# Altium schematic sheet DLY-056_电机原理图.SchDoc
size A3
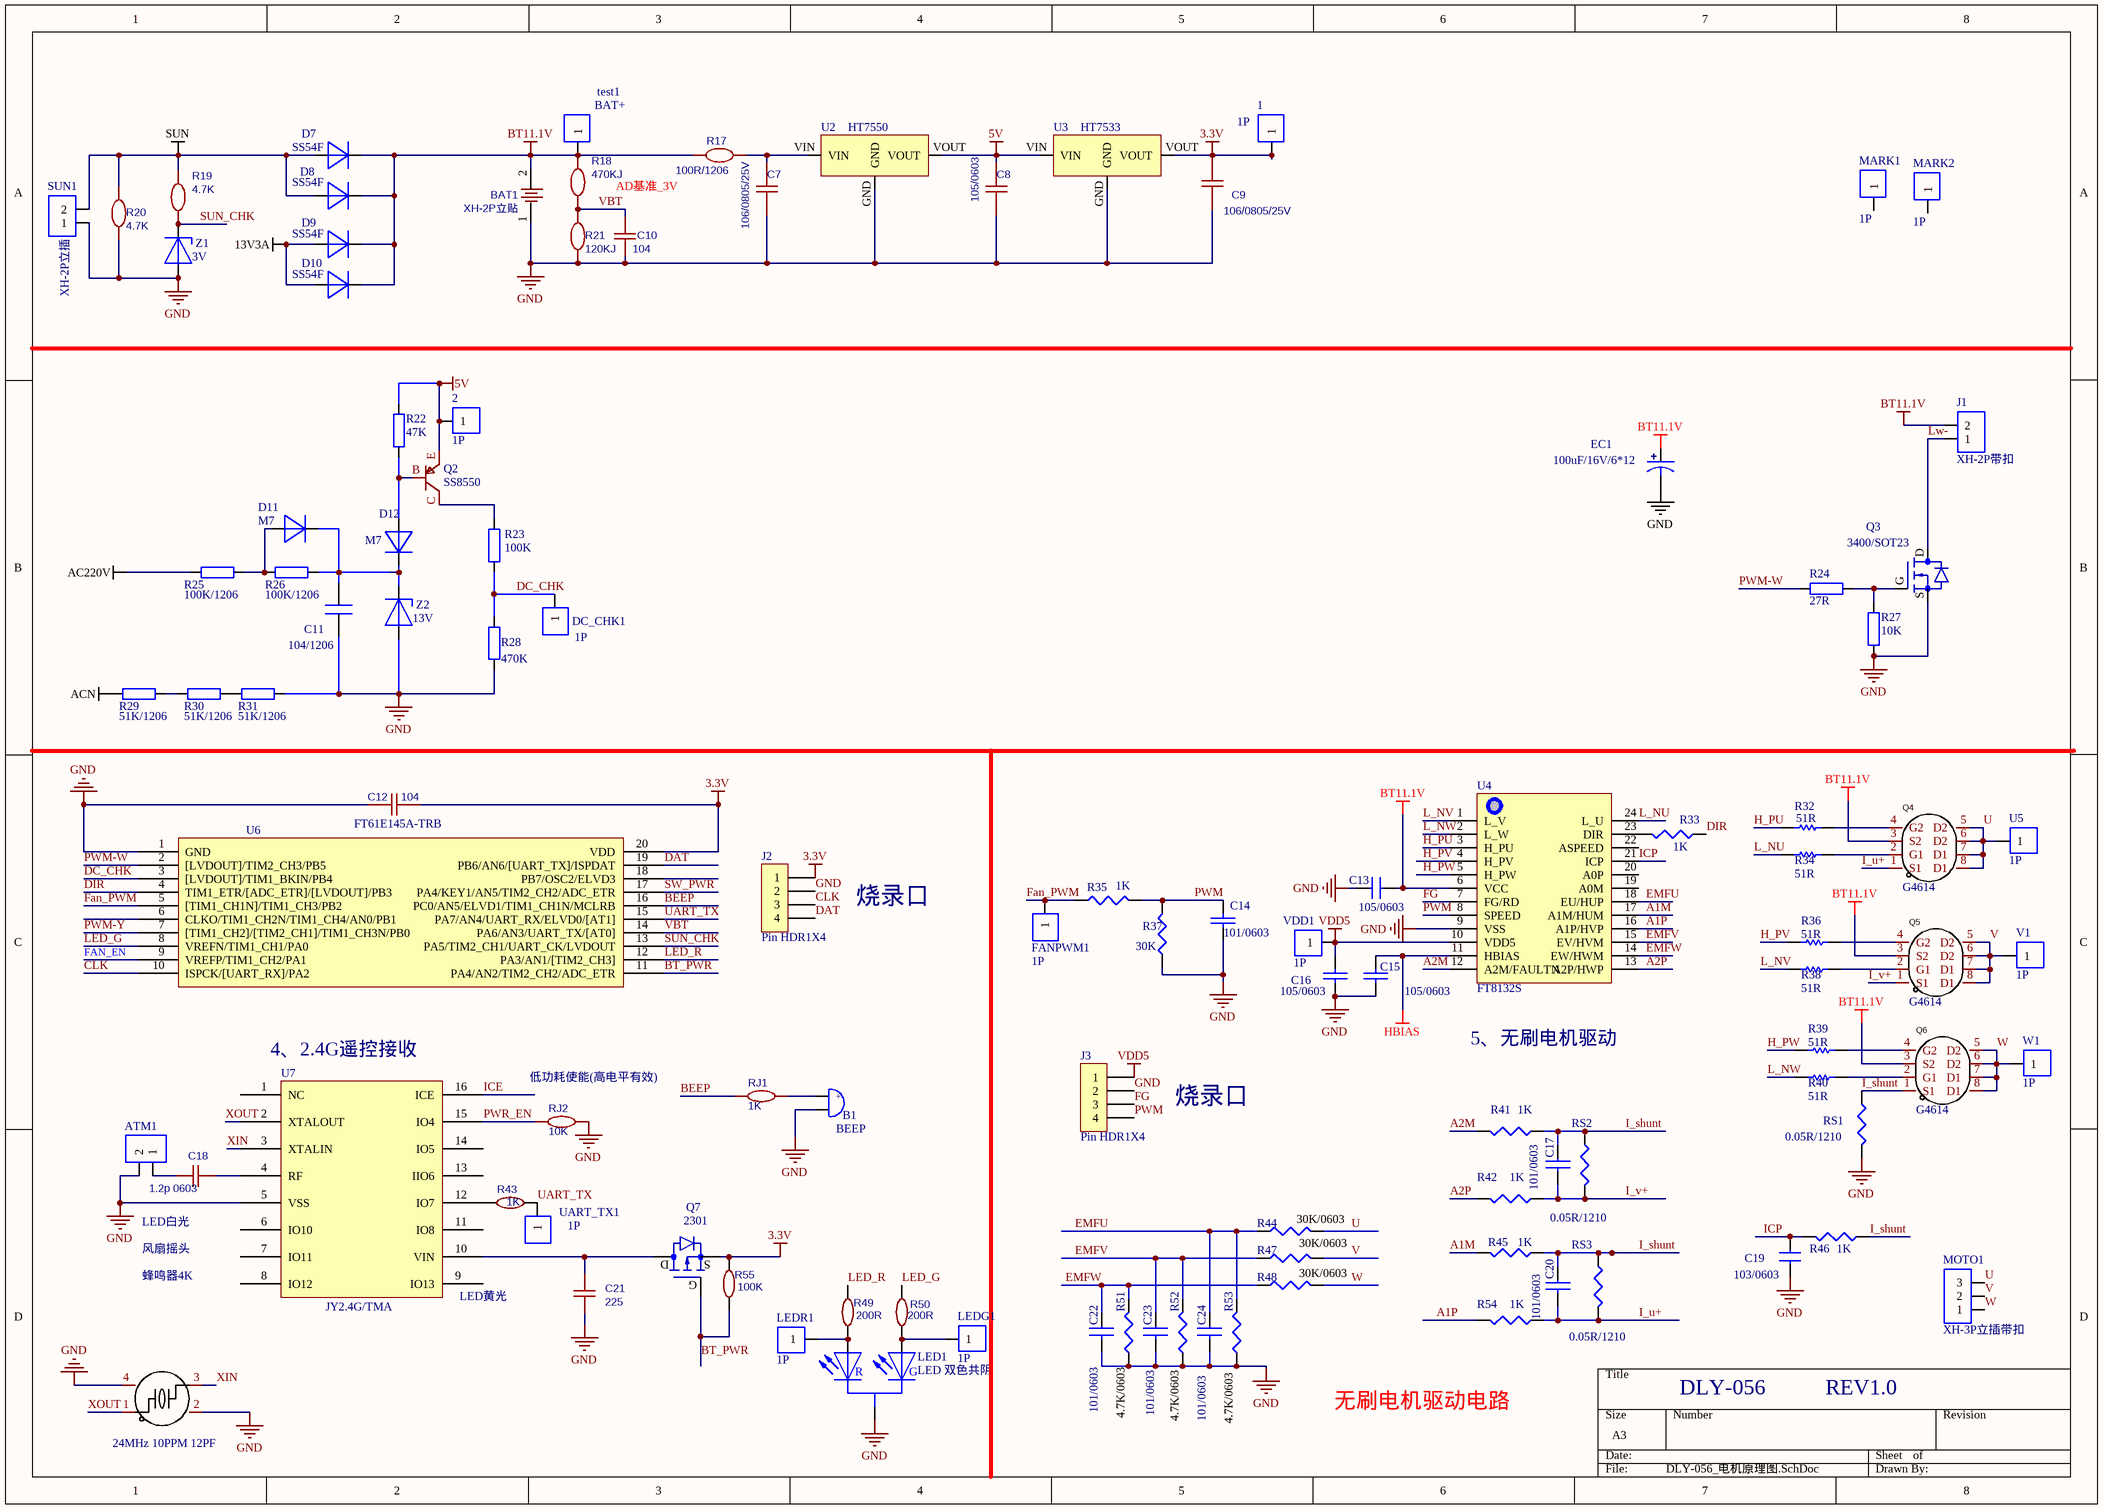
[diagram p0: DLY-056_电机原理图.SchDoc]

## Parts
1  1P  [TEST3.0_top]
2  1P  [TEST3.0_top]
ATM1  2P  [SMT-ATN天线]  (value not drawn)
B1  BEEP  [MI-蜂鸣器-1407]
BAT1  XH-2P立贴  [MI-VH2-2.5]
C7  106/0805/25V  [0805_c]
C8  105/0603  [0603_c]
C9  106/0805/25V  [0603_c]
C10  104  [0603_C]
C11  104/1206  [1206_C]
C12  104  [0603_C]
C13  105/0603  [0603_C]
C14  101/0603  [0603_C]
C15  105/0603  [0603_C]
C16  105/0603  [0603_C]
C17  101/0603  [0603_C]
C18  1.2p 0603  [0603_C]
C19  103/0603  [0603_C]
C20  101/0603  [0603_C]
C21  225  [0603_C]
C22  101/0603  [0603_C]
C23  101/0603  [0603_C]
C24  101/0603  [0603_C]
D7  SS54F  [SMT-SMA]
D8  SS54F  [SMT-SMA]
D9  SS54F  [SMT-SMA]
D10  SS54F  [SMT-SMA]
D11  M7  [SMT-SOD123锡膏]
D12  M7  [SMT-SOD123锡膏]
DC_CHK1  1P  [TEST3.0_top]
EC1  100uF/16V/6*12  [DIP-EC2.5X6.3X11.2]
FANPWM1  1P  [TEST3.0_top]
J1  XH-2P带扣  [MI-VH2-2.5]
J2  Pin HDR1X4  [烧录口]
J3  Pin HDR1X4  [烧录口]
LED1  LED 双色共阴  [PH2.0-3P]
LEDG1  1P  [TEST3.0_top]
LEDR1  1P  [TEST3.0_top]
MARK1  1P  [SMT-MARK]
MARK2  1P  [SMT-MARK]
MOTO1  XH-3P立插带扣  [MI-VH3-2.5]
Q2  SS8550  [SMT-三极管-SOT23锡膏]
Q3  3400/SOT23  [SMT-MOS管-SOT23锡膏]
Q4  G4614  [SOIC-8_150mil]
Q5  G4614  [SOIC-8_150mil]
Q6  G4614  [SOIC-8_150mil]
Q7  2301  [SMT-MOS管-SOT23锡膏]
R17  100R/1206  [SMT-1206r]
R18  470KJ  [0603_R]
R19  4.7K  [0603_R]
R20  4.7K  [0603_R]
R21  120KJ  [0603_R]
R22  47K  [SMT-0603R]
R23  100K  [SMT-0603R]
R24  27R  [SMT-0603R]
R25  100K/1206  [SMT-1206]
R26  100K/1206  [SMT-1206]
R27  10K  [SMT-0603R]
R28  470K  [SMT-0603R]
R29  51K/1206  [SMT-1206]
R30  51K/1206  [SMT-1206]
R31  51K/1206  [SMT-1206]
R32  51R  [SMT-0603R]
R33  1K  [SMT-0603R]
R34  51R  [SMT-0603R]
R35  1K  [SMT-0603R]
R36  51R  [SMT-0603R]
R37  30K  [SMT-0603R]
R38  51R  [SMT-0603R]
R39  51R  [SMT-0603R]
R40  51R  [SMT-0603R]
R41  1K  [SMT-0603R]
R42  1K  [SMT-0603R]
R43  1K  [SMT-0603R]
R44  30K/0603  [SMT-0603R]
R45  1K  [SMT-0603R]
R46  1K  [SMT-0603R]
R47  30K/0603  [SMT-0603R]
R48  30K/0603  [SMT-0603R]
R49  200R  [SMT-0603R]
R50  200R  [SMT-0603R]
R51  4.7K/0603  [SMT-0603R]
R52  4.7K/0603  [SMT-0603R]
R53  4.7K/0603  [SMT-0603R]
R54  1K  [SMT-0603R]
R55  100K  [SMT-0603R]
RJ1  1K  [SMT-0603R]
RJ2  10K  [SMT-0603R]
RS1  0.05R/1210  [SMT-1210]
RS2  0.05R/1210  [SMT-1210]
RS3  0.05R/1210  [SMT-1210]
SUN1  XH-2P立插  [MI-VH2-2.5]
test1  BAT+  [test3.0_top]
U2  HT7550  [SMT-LDO-SOT23锡膏]
U3  HT7533  [SMT-LDO-SOT23锡膏]
U4  FT8132S  [TSSOP-24]
U5  1P  [TEST3.0_top]
U6  FT61E145A-TRB  [TSSOP-20]
U7  JY2.4G/TMA  [SOIC-16_150mil]
UART_TX1  1P  [TEST3.0_top]
V1  1P  [TEST3.0_top]
VDD1  1P  [TEST3.0_top]
W1  1P  [TEST3.0_top]
X1  X32258MOB4SI  [OSC 3225-4P]  (value not drawn)
Z1  3V  [SMT-SOD123锡膏]
Z2  13V  [SMT-SOD123锡膏]

## Nets
3.3V: 1.1 C9.1 C12.1 J2.1 Q7.S R55.1 U3.VOUT U6.20(VDD)
5V: 2.1 C8.1 Q2.E R22.2 U2.VOUT U3.VIN
13V3A: D9.1 D10.1
AC220V: R25.1
ACN: R29.1
BT11.1V: BAT1.2 C13.2 D7.2 D8.2 D9.2 D10.2 EC1.1 J1.2 Q4.3(S2) Q5.3(S2) Q6.3(S2) R17.2 R18.2 test1.1 U4.6(VCC)
GND: ATM1.2 B1.2 BAT1.1 C7.2 C8.2 C9.2 C10.2 C11.1 C12.2 C13.1 C14.2 C15.1 C16.1 C19.2 C21.1 C22.2 C23.2 C24.2 EC1.2 J2.2 J3.2 LED1.2 Q3.S R20.1 R21.1 R27.1 R28.2 R31.2 R37.1 R51.1 R52.1 R53.1 RJ2.1 RS1.2 SUN1.1 U2.GND U3.GND U4.9(VSS) U6.1(GND) U7.5(VSS) X1.2(GND) X1.4(GND) Z1.1 Z2.1
HBIAS: C15.2 U4.11(HBIAS)
SUN: D7.1 D8.1 R19.2 R20.2 SUN1.2
VDD5: C16.2 J3.1 U4.10(VDD5) VDD1.1
A1M: R45.2 U4.17(A1M/HUM)
A1P: R54.2 U4.16(A1P/HVP)
A2M: R41.2 U4.12(A2M/FAULTN)
A2P: R42.2 U4.13(A2P/HWP)
BEEP: RJ1.1 U6.16(PC0/AN5/ELVD1/TIM1_CH1N/MCLRB)
BT_PWR: Q7.G R55.2 U6.11(PA4/AN2/TIM2_CH2/ADC_ETR)
CLK: J2.3 U6.10(ISPCK/[UART_RX]/PA2)
DAT: J2.4 U6.19(PB6/AN6/[UART_TX]/ISPDAT)
DC_CHK: DC_CHK1.1 R23.1 R28.1 U6.3([LVDOUT]/TIM1_BKIN/PB4)
DIR: R33.1 U6.4(TIM1_ETR/[ADC_ETR]/[LVDOUT]/PB3)
EMFU: C24.1 R44.1 R53.2 U4.18(EU/HUP)
EMFV: C23.1 R47.1 R52.2 U4.15(EV/HVM)
EMFW: C22.1 R48.1 R51.2 U4.14(EW/HWM)
FAN_EN: U6.9(VREFP/TIM1_CH2/PA1)
Fan_PWM: FANPWM1.1 R35.1 U6.5([TIM1_CH1N]/TIM1_CH3/PB2)
FG: J3.3 U4.7(FG/RD)
H_PU: R32.1 U4.3(H_PU)
H_PV: R36.1 U4.4(H_PV)
H_PW: R39.1 U4.5(H_PW)
I_shunt: C17.1 C20.1 Q6.1(S1) R41.1 R45.1 R46.1 RS1.1 RS2.1 RS3.1
I_u+: C20.2 Q4.1(S1) R54.1 RS3.2
I_v+: C17.2 Q5.1(S1) R42.1 RS2.2
ICE: U7.16(ICE)
ICP: C19.1 R46.2 U4.21(ICP)
L_NU: R34.1 U4.24(L_U)
L_NV: R38.1 U4.1(L_V)
L_NW: R40.1 U4.2(L_W)
LED_G: R50.1 U6.8(VREFN/TIM1_CH1/PA0)
LED_R: R49.1 U6.12(PA3/AN1/[TIM2_CH3])
Lw-: J1.1 Q3.D
PWM: C14.1 J3.4 R35.2 R37.2 U4.8(SPEED)
PWM-W: R24.1 U6.2([LVDOUT]/TIM2_CH3/PB5)
PWM-Y: U6.7([TIM1_CH2]/[TIM2_CH1]/TIM1_CH3N/PB0)
PWR_EN: RJ2.2 U7.15(IO4)
SUN_CHK: R19.1 U6.13(PA5/TIM2_CH1/UART_CK/LVDOUT) Z1.2
SW_PWR: U6.17(PA4/KEY1/AN5/TIM2_CH2/ADC_ETR)
U: MOTO1.3 Q4.5(D2) Q4.6(D2) Q4.7(D1) Q4.8(D1) R44.2 U5.1
UART_TX: R43.1 U6.15(PA7/AN4/UART_RX/ELVD0/[AT1]) UART_TX1.1
V: MOTO1.2 Q5.5(D2) Q5.6(D2) Q5.7(D1) Q5.8(D1) R47.2 V1.1
VBT: C10.1 R18.1 R21.2 U6.14(PA6/AN3/UART_TX/[AT0])
W: MOTO1.1 Q6.5(D2) Q6.6(D2) Q6.7(D1) Q6.8(D1) R48.2 W1.1
XIN: U7.3(XTALIN) X1.3(XOUT)
XOUT: U7.2(XTALOUT) X1.1(XIN)
NetATM1_1: ATM1.1 C18.2
NetB1_1: B1.1 RJ1.2
NetC7_1: C7.1 R17.1 U2.VIN
NetC11_2: C11.2 D11.2 D12.2 R26.2 Z2.2
NetC18_1: C18.1 U7.4(RF)
NetC21_2: C21.2 Q7.D U7.10(VIN)
NetD11_1: D11.1 R25.2 R26.1
NetD12_1: D12.1 Q2.B R22.1
NetLED1_1: LED1.1 LEDR1.1 R49.2
NetLED1_3: LED1.3 LEDG1.1 R50.2
NetQ2_C: Q2.C R23.2
NetQ3_G: Q3.G R24.2 R27.2
NetQ4_2: Q4.2(G1) R34.2
NetQ4_4: Q4.4(G2) R32.2
NetQ5_2: Q5.2(G1) R38.2
NetQ5_4: Q5.4(G2) R36.2
NetQ6_2: Q6.2(G1) R40.2
NetQ6_4: Q6.4(G2) R39.2
NetR29_2: R29.2 R30.1
NetR30_2: R30.2 R31.1
NetR33_2: R33.2 U4.23(DIR)
NetR43_2: R43.2 U7.12(IO7)

Not connected (* = marked no-connect by the designer): MARK1 1; MARK2 1; U4 19(A0M) 20(A0P) 22(ASPEED); U6 6(CLKO/TIM1_CH2N/TIM1_CH4/AN0/PB1) 18(PB7/OSC2/ELVD3); U7 1(NC) 6(IO10) 7(IO11) 8(IO12) 9(IO13) 11(IO8) 13(IIO6) 14(IO5)

## Notes on the sheet
- 烧录口
- (near U7) 4、2.4G遥控接收
- 5、无刷电机驱动
- (near RJ2) 低功耗使能(高电平有效)
- 风扇摇头
- LED白光
- 蜂鸣器4K
- (near U7) LED黄光
- DLY-056
- REV1.0
- (near X1) 24MHz 10PPM 12PF
- 无刷电机驱动电路
- (in symbol BEEP) +
- (in symbol LED 双色共阴) R; G

## Library data of the parts
B1 = BEEP: 蜂鸣器
BAT1 = 12V: BOM_Manufacturer: Q&J; BOM_Manufacturer Part: CR1220-2; BOM_Supplier: LCSC; image: //image.lceda.cn/szlcsc/C70381.jpg; BOM_Supplier Part: C70381; spicePre: B; spiceSymbolName: CR1220-2
C7-C9 = 0.1u: nameAlias: Value(F); Contributor: LCEDA_Lib; spicePre: C; spiceSymbolName: C_0603_US
C10 = 100nF: BOM_Manufacturer: Walsin Tech Corp; BOM_Manufacturer Part: 0402X224J100CT; nameAlias: Capacitance; Contributor: LCSC; BOM_Supplier: LCSC; BOM_Supplier Part: C295939; spicePre: C; spiceSymbolName: 0402X224J100CT
C11 = Cap
C12 = 102/400V: BOM_Manufacturer: SAMSUNG; BOM_Manufacturer Part: CL10B104KA8NNNC; nameAlias: Capacitance; BOM_Supplier: LCSC; BOM_Supplier Part: C1590; spicePre: C; spiceSymbolName: CL10B104KA8NNNC
C13 C14 C19 = CAP: Capacitor
C15 C16 = CAP-CC: Capacitor
C17 C20 C22-C24 = CAP NP: Text Field1: 20; Text Field2: 10
C18 C21 = 100nF: 0603; BOM_Manufacturer: Walsin Tech Corp; BOM_Manufacturer Part: 0402X224J100CT; nameAlias: Capacitance; Contributor: LCSC; BOM_Supplier: LCSC; BOM_Supplier Part: C295939; spicePre: C; spiceSymbolName: 0402X224J100CT
D7-D12 = Diode
EC1 = SMD_ECAP: 贴片电解电容
J1 SUN1 = 2P
MOTO1 = 3P
Q2 = PNP
Q3 = N MOS
Q4-Q6 = G4614: Add into BOM: yes; Name: G4614; Symbol: G4614; Device: G4614; LCSC Part Name: G4614; Supplier Part: C7465424; Manufacturer Part: G4614; Supplier Footprint: SOP-8; Datasheet: https://atta.szlcsc.com/upload/public/pdf/source/20230719/26D75AFD91122D699FFA118337651D12.pdf; Supplier: LCSC; Convert to PCB: yes
Q7 = P MOS
R17-R21 = 1k: Contributor: LCEDA_Lib; spicePre: R; spiceSymbolName: R_0603_EU
R22-R31 = Res
R32 R34 R36 R38-R40 = RES
R33 R35 R37 R41 R42 R44-R48 R51-R54 RS1-RS3 = RES(SMD)
R43 R49 R50 R55 = 51K: BOM_Manufacturer: UniOhm; BOM_Manufacturer Part: 0402WGJ0165TCE; nameAlias: Resistance (Ohms); BOM_Supplier: LCSC; BOM_Supplier Part: C57065; spicePre: R; spiceSymbolName: 0402WGJ0165TCE
RJ1 RJ2 = 300K: BOM_Manufacturer: Tyohm; BOM_Manufacturer Part: RMC04024.7K1%N; nameAlias: Resistance (Ohms); Contributor: LCSC; BOM_Supplier: LCSC; BOM_Supplier Part: C270129; spicePre: R; spiceSymbolName: RMC04024.7K1%N
test1 = 1P
U2 U3 = IC HT7550
U4 = FT8131S: FT8131Q SSOP24
U6 = FT61F145A-RB
U7 = Component_1: SOP16
X1 = X32258MOB4SI: 24MHz 10PPM 12PF; Manufacturer: YXC(扬兴晶振); Name: 8MHz; Add into BOM: yes; Crystal Type: 贴片无源晶振; Value: 8MHz; Frequency Stability: ±30ppm; Equivalent Series Resistance (ESR): 150Ω; Symbol: X32258MOB4SI; Device: X32258MOB4SI; LCSC Part Name: 8MHz ±10ppm 12pF YSX321SL; Supplier Part: C2682775; Manufacturer Part: X32258MOB4SI; Supplier Footprint: SMD3225-4P; JLCPCB Part Class: Extended Part; Datasheet: https://atta.szlcsc.com/upload/public/pdf/source/20210106/C2682774_0CD4FDA5D9DA3FBEEC23BD607A48E4B0.pdf; Supplier: LCSC; Convert to PCB: yes; Frequency Tolerance: ±10ppm; Load Capacitance: 12pF; Operating Temperature: -40℃~+85℃
Z1 Z2 = Diode Z